# EAGLE schematic board_Nutzen (EAGLE 8.7.0)

## Sheet 1 of 7

## Sheet 2 of 7
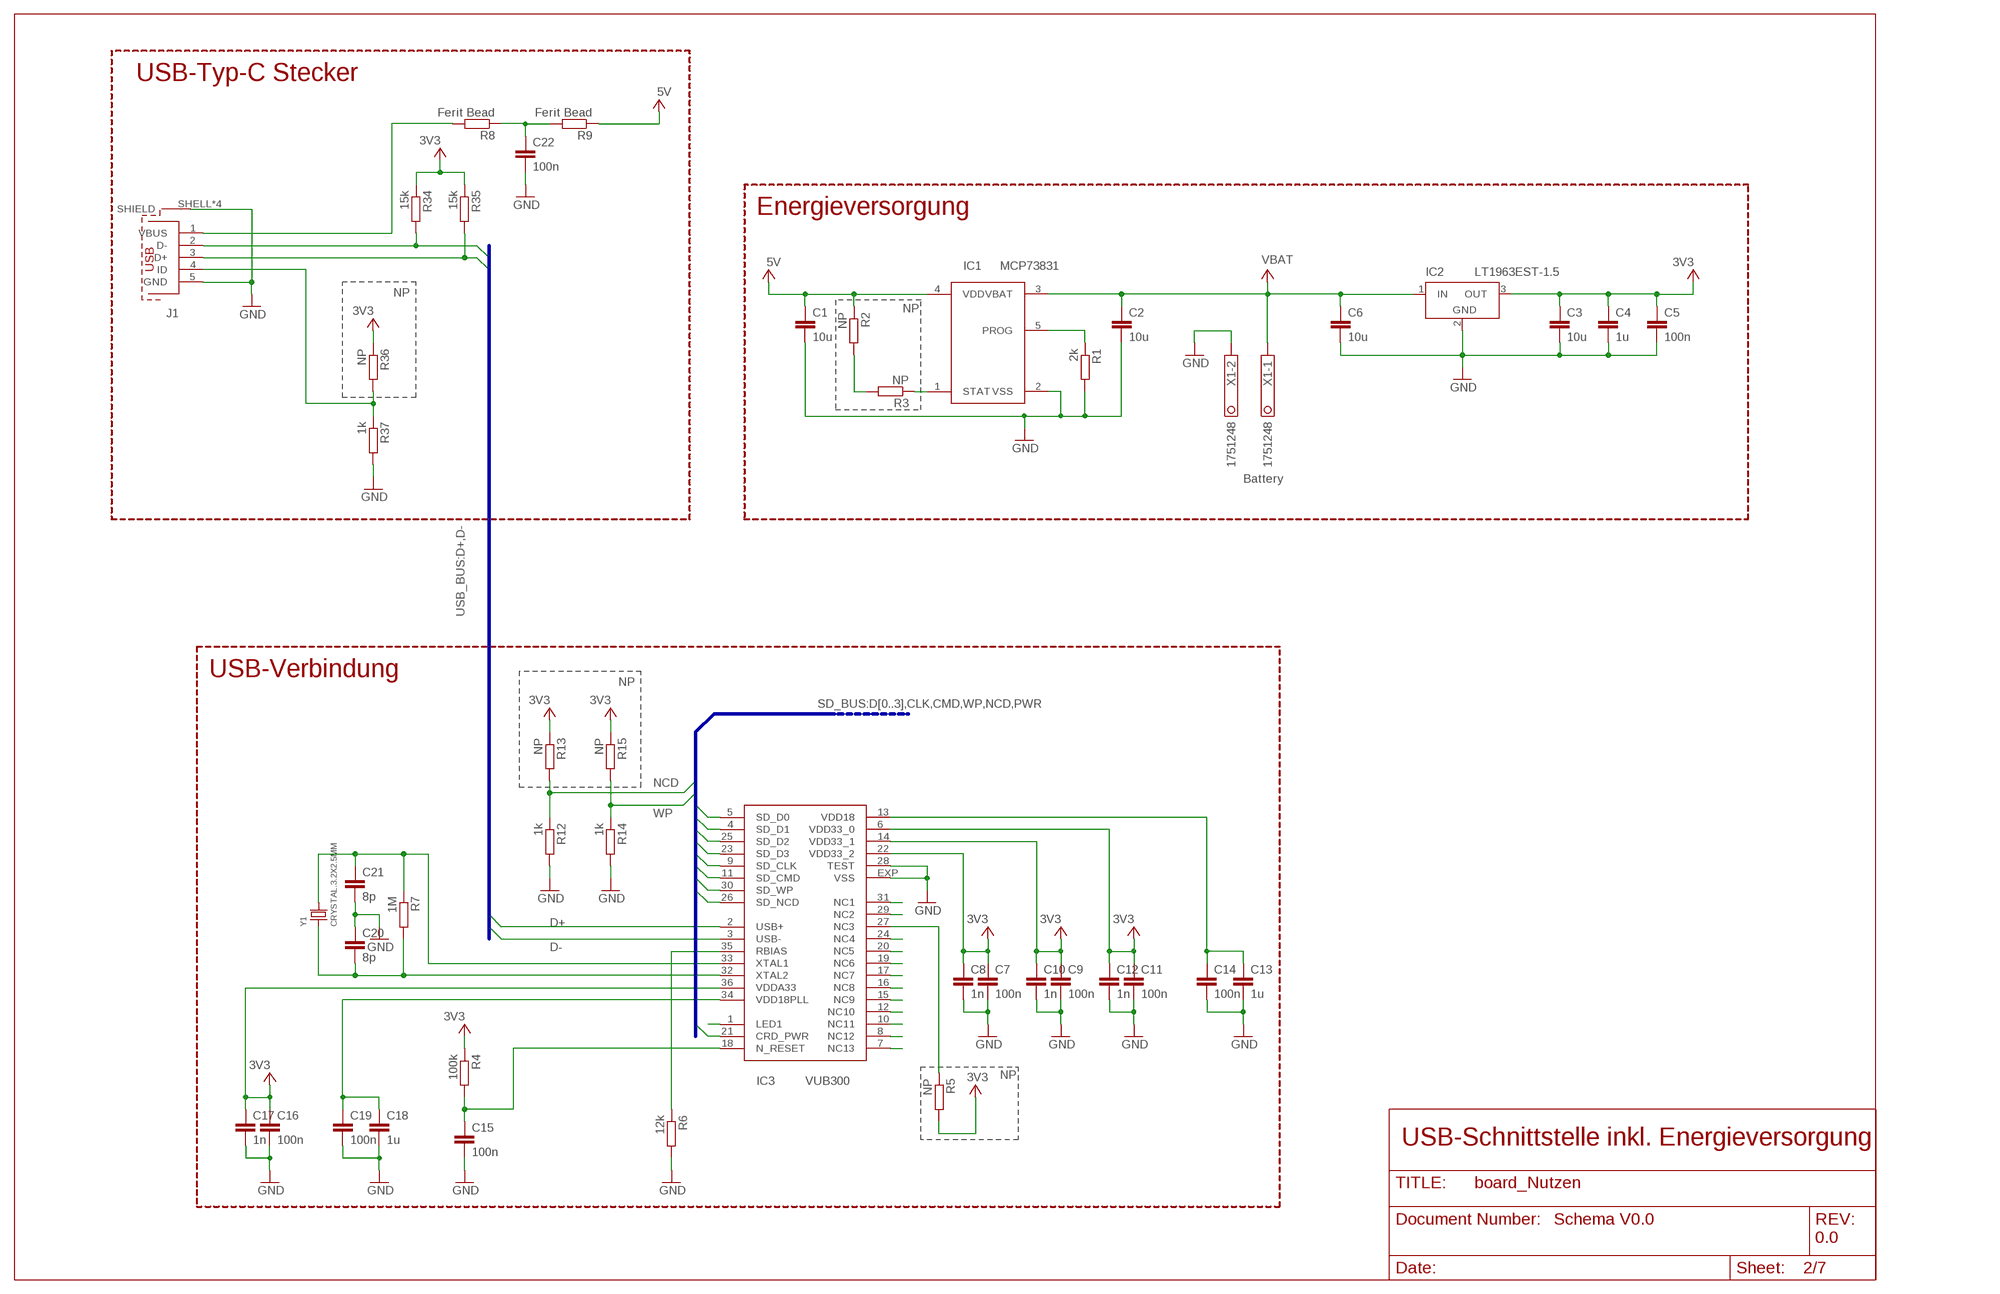
[diagram p0: schematic, sheet 2]

### Parts
C1  10u  C-EUC0805  [C0805]
C2  10u  C-EUC0805  [C0805]
C3  10u  C-EUC0805  [C0805]
C4  1u  C-EUC0603  [C0603]
C5  100n  C-EUC0603  [C0603]
C6  10u  C-EUC0805  [C0805]
C7  100n  C-EUC0402  [C0402]
C8  1n  C-EUC0402  [C0402]
C9  100n  C-EUC0402  [C0402]
C10  1n  C-EUC0402  [C0402]
C11  100n  C-EUC0402  [C0402]
C12  1n  C-EUC0402  [C0402]
C13  1u  C-EUC0402  [C0402]
C14  100n  C-EUC0402  [C0402]
C15  100n  C-EUC0402  [C0402]
C16  100n  C-EUC0402  [C0402]
C17  1n  C-EUC0402  [C0402]
C18  1u  C-EUC0402  [C0402]
C19  100n  C-EUC0402  [C0402]
C20  8p  C-EUC0402  [C0402]
C21  8p  C-EUC0402  [C0402]
C22  100n  C-EUC0603  [C0603]
IC1  MCP73831  [SOT23-5]
IC2  LT1963EST-1.5  [SOT223]
IC3  VUB300  [QFN36-6X6]
J1  629105136821  [629105136821]
R1  2k  R-EU_R0603  [R0603]
R2  NP  R-EU_R0603  [R0603]
R3  NP  R-EU_R0603  [R0603]
R4  100k  R-EU_R0402  [R0402]
R5  NP  R-EU_R0402  [R0402]
R6  12k  R-EU_R0402  [R0402]
R7  1M  R-EU_R0402  [R0402]
R8  Ferit Bead  R-EU_R0603  [R0603]
R9  Ferit Bead  R-EU_R0603  [R0603]
R12  1k  R-EU_R0603  [R0603]
R13  NP  R-EU_R0603  [R0603]
R14  1k  R-EU_R0603  [R0603]
R15  NP  R-EU_R0603  [R0603]
R34  15k  R-EU_R0402  [R0402]
R35  15k  R-EU_R0402  [R0402]
R36  NP  R-EU_R0603  [R0603]
R37  1k  R-EU_R0603  [R0603]
X1  1751248  [1751248]
Y1  CRYSTAL.3.2X2.5MM  [3.2X2.5MM]

### Nets
+3V3: C3.1 C4.1 C5.1 C7.1 C8.1 C9.1 C10.1 C11.1 C12.1 C16.1 C17.1 IC2.3(OUT) IC3.6(VDD33_0) IC3.14(VDD33_1) IC3.22(VDD33_2) IC3.36(VDDA33) R4.1 R5.2 R13.1 R15.1 R34.1 R35.1 R36.1 ; supply symbol labelled 3V3 ; also sheet 3,4,5,6,7
+5V: C1.1 IC1.4(VDD) R2.1 R9.1 ; supply symbol labelled 5V ; also sheet 5
CLK: IC3.9(SD_CLK) ; also sheet 3,5,6
CMD: IC3.11(SD_CMD) ; also sheet 3,5,6
D0: IC3.5(SD_D0) ; also sheet 3,5,6
D1: IC3.4(SD_D1) ; also sheet 3,5,6
D2: IC3.25(SD_D2) ; also sheet 3,5,6
D3: IC3.23(SD_D3) ; also sheet 3,5,6
D+: IC3.2(USB+) J1.3(D+) R35.2 ; also sheet 5
D-: IC3.3(USB-) J1.2(D-) R34.2 ; also sheet 5
GND: C1.2 C2.2 C3.2 C4.2 C5.2 C6.2 C7.2 C8.2 C9.2 C10.2 C11.2 C12.2 C13.2 C14.2 C15.2 C16.2 C17.2 C18.2 C19.2 C20.1 C21.2 C22.2 IC1.2(VSS) IC2.2(GND) IC3.28(TEST) IC3.EXP(VSS) J1.5(GND) J1.SHELL1(SHIELD) J1.SHELL2(SHIELD) J1.SHELL3(SHIELD) J1.SHELL(SHIELD) R1.2 R6.2 R12.2 R14.2 R37.2 X1.2 ; also sheet 3,4,5,6,7
N$1: IC1.5(PROG) R1.1
N$2: R2.2 R3.2
N$3: IC1.1(STAT) R3.1
N$4: IC3.1(LED1)
N$5: J1.4(ID) R36.2 R37.1
N$19: IC3.8(NC12)
N$20: IC3.7(NC13)
N$21: IC3.10(NC11)
N$22: IC3.12(NC10)
N$23: IC3.24(NC4)
N$24: IC3.15(NC9)
N$25: IC3.16(NC8)
N$26: IC3.17(NC7)
N$27: C15.1 IC3.18(N_RESET) R4.2
N$28: IC3.27(NC3) R5.1
N$29: IC3.19(NC6)
N$30: IC3.20(NC5)
N$31: IC3.35(RBIAS) R6.1
N$32: IC3.29(NC2)
N$33: IC3.31(NC1)
N$34: J1.1(VBUS) R8.2
N$35: C20.2 IC3.32(XTAL2) R7.2 Y1.1
N$36: C21.1 IC3.33(XTAL1) R7.1 Y1.3
N$37: C22.1 R8.1 R9.2
NCD: IC3.26(SD_NCD) R12.1 R13.2 ; also sheet 5
PWR: IC3.21(CRD_PWR) ; also sheet 3,5,6
V+: C2.1 C6.1 IC1.3(VBAT) IC2.1(IN) X1.1 ; supply symbol labelled VBAT ; also sheet 4,5,7
VDD18: C13.1 C14.1 IC3.13(VDD18) ; also sheet 5
VDD18PLL: C18.1 C19.1 IC3.34(VDD18PLL) ; also sheet 5
WP: IC3.30(SD_WP) R14.1 R15.2 ; also sheet 5

### Buses
SD_BUS:D[0..3],CLK,CMD,WP,NCD,PWR
USB_BUS:D+,D-

### Notes on the sheet
- USB-Typ-C Stecker
- Energieversorgung
- NP
- NP
- Battery
- USB-Verbindung | NP
- NP
- USB-Schnittstelle inkl. Energieversorgung
- Schema V0.0
- 0.0

## Sheet 3 of 7
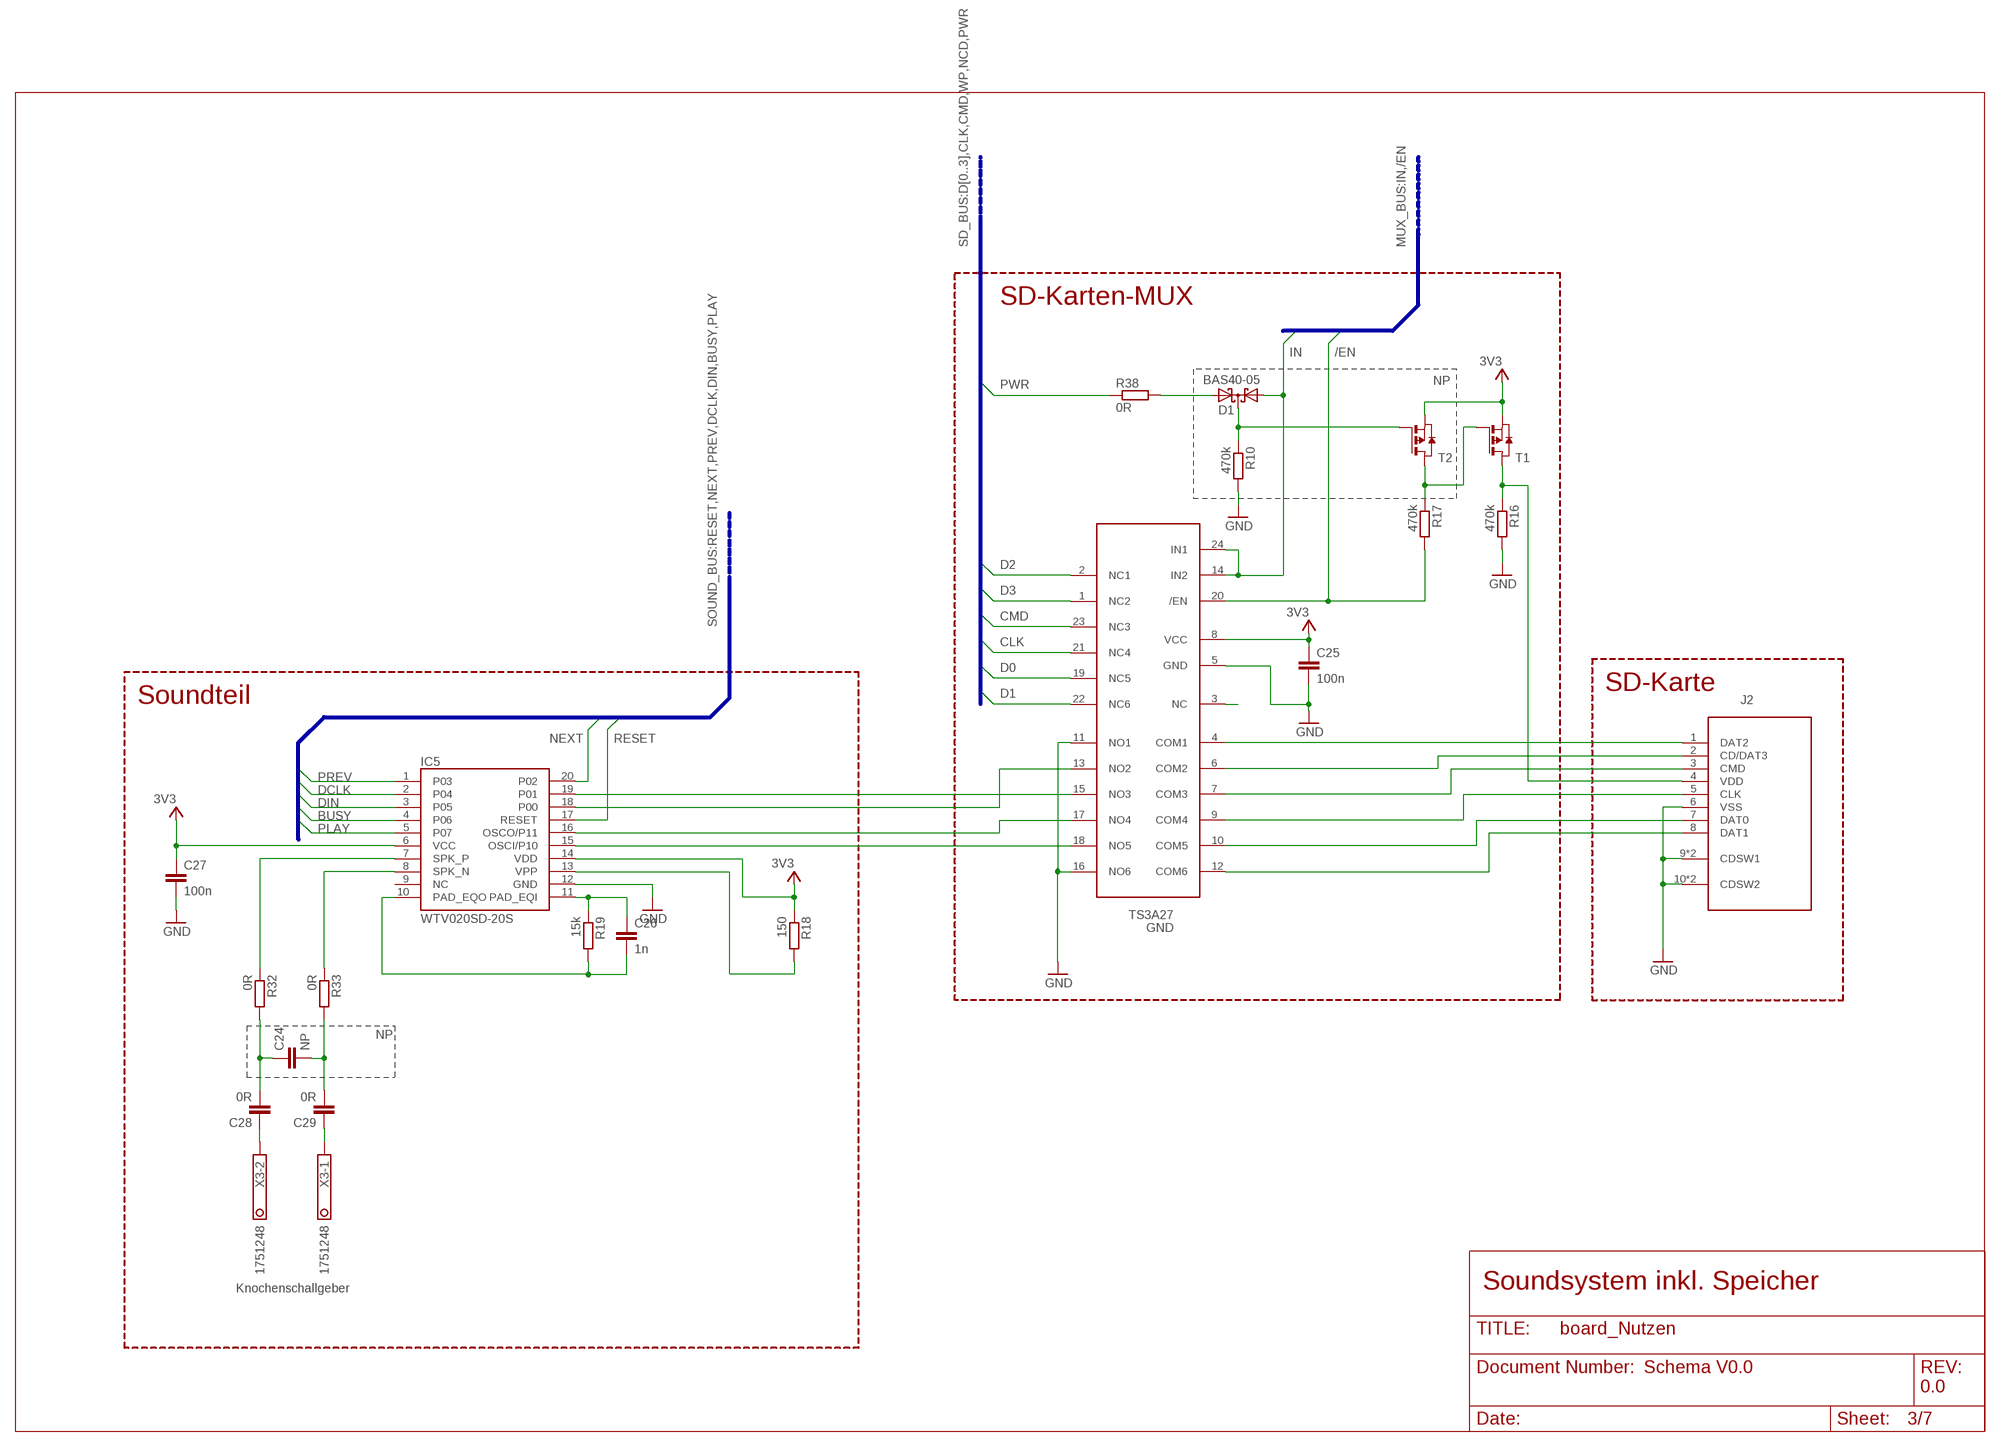
[diagram p1: schematic, sheet 3]

### Parts
C24  NP  C-EUC0603  [C0603]
C25  100n  C-EUC0603  [C0603]
C26  1n  C-EUC0603  [C0603]
C27  100n  C-EUC0603  [C0603]
C28  0R  C-EUC0603  [C0603]
C29  0R  C-EUC0603  [C0603]
D1  BAS40-05  [SOT23]
GND  TS3A27  [TSSOP24]
IC5  WTV020SD-20S  WTV020SD  [SSOP_20]
J2  693071010811  [693071010811]
R10  470k  R-EU_R0603  [R0603]
R16  470k  R-EU_R0603  [R0603]
R17  470k  R-EU_R0603  [R0603]
R18  150  R-EU_R0603  [R0603]
R19  15k  R-EU_R0603  [R0603]
R32  0R  R-EU_R0603  [R0603]
R33  0R  R-EU_R0603  [R0603]
R38  0R  R-EU_MELF0102W  [MINI_MELF-0102W]
T1  PMOSSOT23  [SOT-23]
T2  PMOSSOT23  [SOT-23]
X3  1751248  [1751248]

### Nets
+3V3: C25.1 C27.1 GND.8(VCC) IC5.6(VCC) IC5.14(VDD) R18.1 T1.2(S) T2.2(S) ; supply symbol labelled 3V3 ; also sheet 2,4,5,6,7
/EN: GND.20(/EN) R17.2 ; also sheet 4,6,7
BUSY: IC5.4(P06) ; also sheet 4,6,7
CLK: GND.21(NC4) ; also sheet 2,5,6
CMD: GND.23(NC3) ; also sheet 2,5,6
D0: GND.19(NC5) ; also sheet 2,5,6
D1: GND.22(NC6) ; also sheet 2,5,6
D2: GND.2(NC1) ; also sheet 2,5,6
D3: GND.1(NC2) ; also sheet 2,5,6
DCLK: IC5.2(P04) ; also sheet 4,6,7
DIN: IC5.3(P05) ; also sheet 4,6,7
GND: C25.2 C27.2 GND.5(GND) GND.11(NO1) GND.16(NO6) IC5.12(GND) J2.6(VSS) J2.9(CDSW1) J2.9-1(CDSW1) J2.10(CDSW2) J2.10-1(CDSW2) R10.2 R16.2 ; also sheet 2,4,5,6,7
IN: D1.1(A1) GND.14(IN2) GND.24(IN1) ; also sheet 4,6,7
N$8: D1.2(A2) R38.2
N$9: GND.15(NO3) IC5.19(P01)
N$38: GND.9(COM4) J2.5(CLK)
N$39: IC5.13(VPP) R18.2
N$40: C26.1 IC5.11(PAD_EQI) R19.1
N$41: GND.17(NO4) IC5.16(OSCO/P11)
N$42: GND.18(NO5) IC5.15(OSCI/P10)
N$43: GND.4(COM1) J2.1(DAT2)
N$44: GND.12(COM6) J2.8(DAT1)
N$45: GND.6(COM2) J2.2(CD/DAT3)
N$46: R17.1 T1.3(G) T2.1(D)
N$47: GND.3(NC)
N$49: D1.3(C) R10.1 T2.3(G)
N$56: C28.1 X3.2
N$57: C29.1 X3.1
N$58: C24.2 C29.2 R33.2
N$59: C24.1 C28.2 R32.2
NCD1: J2.4(VDD) R16.1 T1.1(D)
NEXT: IC5.20(P02) ; also sheet 4,6,7
PLAY: IC5.5(P07) ; also sheet 4,6,7
PREV: IC5.1(P03) ; also sheet 4,6,7
PWM: C26.2 IC5.10(PAD_EQO) R19.2
PWR: R38.1 ; also sheet 2,5,6
RESET: IC5.17(RESET) ; also sheet 4,6,7
SDCS: GND.13(NO2) IC5.18(P00)
SDDI: GND.7(COM3) J2.3(CMD)
SDDO: GND.10(COM5) J2.7(DAT0)
SPK+: IC5.7(SPK_P) R32.1
SPK-: IC5.8(SPK_N) R33.1
Unconnected: IC5.9(NC)

### Buses
SD_BUS:D[0..3],CLK,CMD,WP,NCD,PWR
MUX_BUS:IN,/EN
SOUND_BUS:RESET,NEXT,PREV,DCLK,DIN,BUSY,PLAY

### Notes on the sheet
- SD-Karten-MUX
- NP
- SD-Karte
- Soundteil
- NP
- Knochenschallgeber
- Soundsystem inkl. Speicher
- Schema V0.0
- 0.0

## Sheet 4 of 7
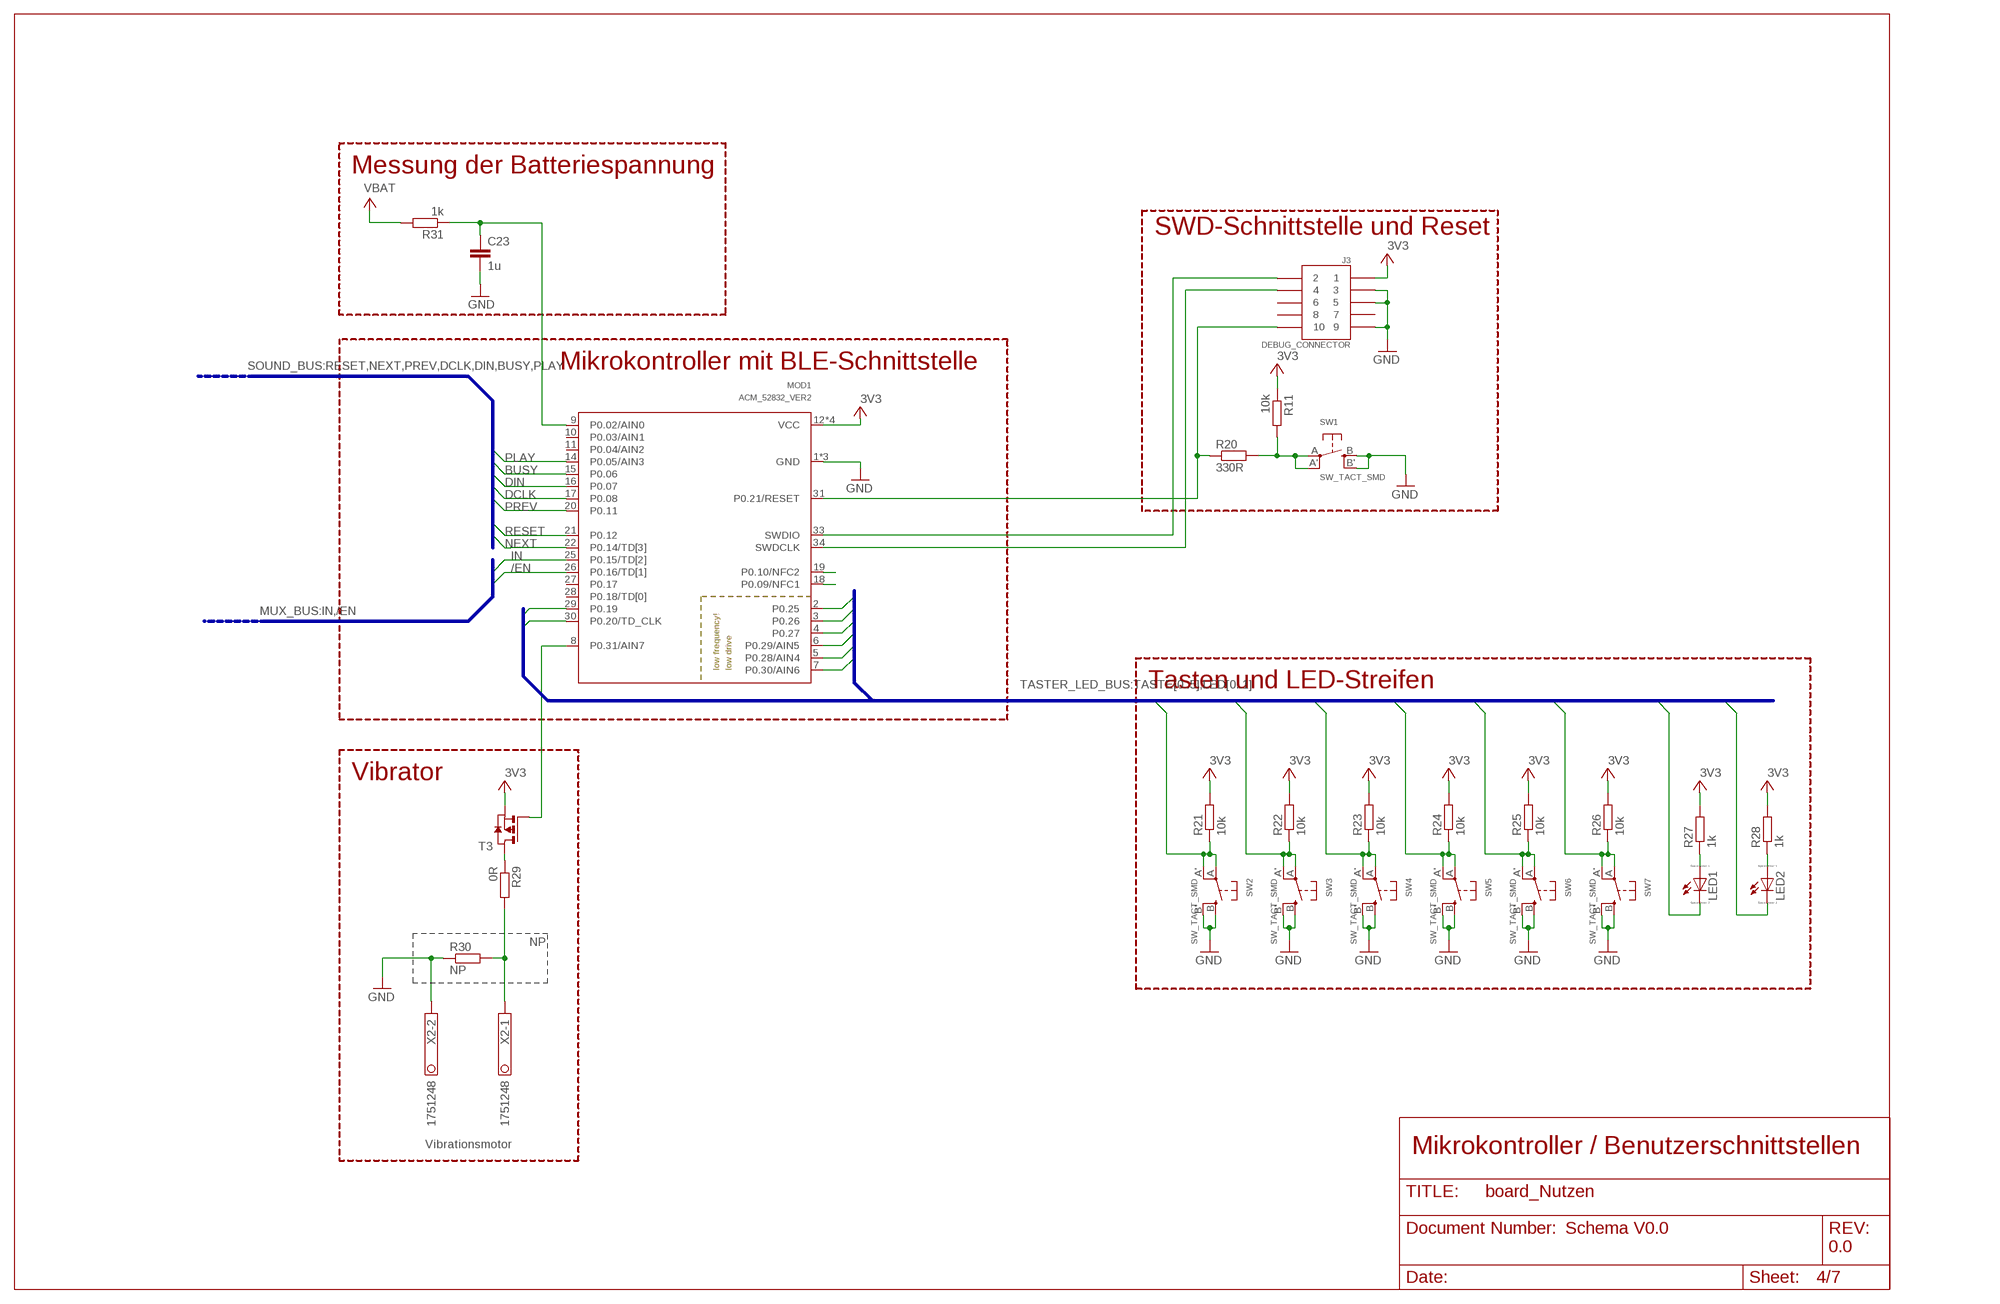
[diagram p2: schematic, sheet 4]

### Parts
C23  1u  C-EUC0603  [C0603]
J3  DEBUG_CONNECTOR  [HDRV127P5X2-10_N]
LED1  LED_E  [LED_1206]
LED2  LED_E  [LED_1206]
MOD1  ACM_52832_VER2  [ACONNO_ACM_52832]
R11  10k  R-EU_R0603  [R0603]
R20  330R  R-EU_R0603  [R0603]
R21  10k  R-EU_R0603  [R0603]
R22  10k  R-EU_R0603  [R0603]
R23  10k  R-EU_R0603  [R0603]
R24  10k  R-EU_R0603  [R0603]
R25  10k  R-EU_R0603  [R0603]
R26  10k  R-EU_R0603  [R0603]
R27  1k  R-EU_R0603  [R0603]
R28  1k  R-EU_R0603  [R0603]
R29  0R  R-EU_R0603  [R0603]
R30  NP  R-EU_R0603  [R0603]
R31  1k  R-EU_R0603  [R0603]
SW1  SW_TACT_SMD  [EVQ-Q2]
SW2  SW_TACT_SMD  [EVQ-Q2]
SW3  SW_TACT_SMD  [EVQ-Q2]
SW4  SW_TACT_SMD  [EVQ-Q2]
SW5  SW_TACT_SMD  [EVQ-Q2]
SW6  SW_TACT_SMD  [EVQ-Q2]
SW7  SW_TACT_SMD  [EVQ-Q2]
T3  PMOSSOT23  [SOT-23]
X2  1751248  [1751248]

### Nets
+3V3: J3.1 MOD1.12(VCC) MOD1.23(VCC) MOD1.24(VCC) MOD1.32(VCC) R11.1 R21.2 R22.2 R23.2 R24.2 R25.2 R26.2 R27.2 R28.2 T3.2(S) ; supply symbol labelled 3V3 ; also sheet 2,3,5,6,7
/EN: MOD1.26(P0.16/TD[1]) ; also sheet 3,6,7
BUSY: MOD1.15(P0.06) ; also sheet 3,6,7
DCLK: MOD1.17(P0.08) ; also sheet 3,6,7
DIN: MOD1.16(P0.07) ; also sheet 3,6,7
GND: C23.2 J3.3 J3.5 J3.9 MOD1.1(GND) MOD1.13(GND) MOD1.35(GND) R30.1 SW1.B'(S1) SW1.B(S) SW2.B'(S1) SW2.B(S) SW3.B'(S1) SW3.B(S) SW4.B'(S1) SW4.B(S) SW5.B'(S1) SW5.B(S) SW6.B'(S1) SW6.B(S) SW7.B'(S1) SW7.B(S) X2.2 ; also sheet 2,3,5,6,7
IN: MOD1.25(P0.15/TD[2]) ; also sheet 3,6,7
LED0: LED1.C MOD1.29(P0.19) ; also sheet 7
LED1: LED2.C MOD1.30(P0.20/TD_CLK) ; also sheet 7
N$6: MOD1.19(P0.10/NFC2)
N$7: MOD1.18(P0.09/NFC1)
N$48: R11.2 R20.2 SW1.A'(P1) SW1.A(P)
N$50: J3.4 MOD1.34(SWDCLK)
N$52: J3.10 MOD1.31(P0.21/RESET) R20.1
N$53: J3.2 MOD1.33(SWDIO)
N$54: LED1.A R27.1
N$55: C23.1 MOD1.9(P0.02/AIN0) R31.1
N$61: LED2.A R28.1
N$63: R29.2 R30.2 X2.1
N$64: MOD1.8(P0.31/AIN7) T3.3(G)
N$65: R29.1 T3.1(D)
NEXT: MOD1.22(P0.14/TD[3]) ; also sheet 3,6,7
PLAY: MOD1.14(P0.05/AIN3) ; also sheet 3,6,7
PREV: MOD1.20(P0.11) ; also sheet 3,6,7
RESET: MOD1.21(P0.12) ; also sheet 3,6,7
TASTE0: MOD1.7(P0.30/AIN6) R21.1 SW2.A'(P1) SW2.A(P) ; also sheet 7
TASTE1: MOD1.5(P0.28/AIN4) R22.1 SW3.A'(P1) SW3.A(P) ; also sheet 7
TASTE2: MOD1.6(P0.29/AIN5) R23.1 SW4.A'(P1) SW4.A(P) ; also sheet 7
TASTE3: MOD1.4(P0.27) R24.1 SW5.A'(P1) SW5.A(P) ; also sheet 7
TASTE4: MOD1.3(P0.26) R25.1 SW6.A'(P1) SW6.A(P) ; also sheet 7
TASTE5: MOD1.2(P0.25) R26.1 SW7.A'(P1) SW7.A(P) ; also sheet 7
V+: R31.2 ; supply symbol labelled VBAT ; also sheet 2,5,7
Unconnected: J3.6 J3.7 J3.8 MOD1.10(P0.03/AIN1) MOD1.11(P0.04/AIN2) MOD1.27(P0.17) MOD1.28(P0.18/TD[0])

### Buses
SOUND_BUS:RESET,NEXT,PREV,DCLK,DIN,BUSY,PLAY
MUX_BUS:IN,/EN
TASTER_LED_BUS:TASTE[0..5],LED[0..1]

### Notes on the sheet
- Messung der Batteriespannung
- SWD-Schnittstelle und Reset
- Mikrokontroller mit BLE-Schnittstelle
- Tasten und LED-Streifen
- Vibrator
- NP
- Vibrationsmotor
- Mikrokontroller / Benutzerschnittstellen
- Schema V0.0
- 0.0

## Sheet 5 of 7
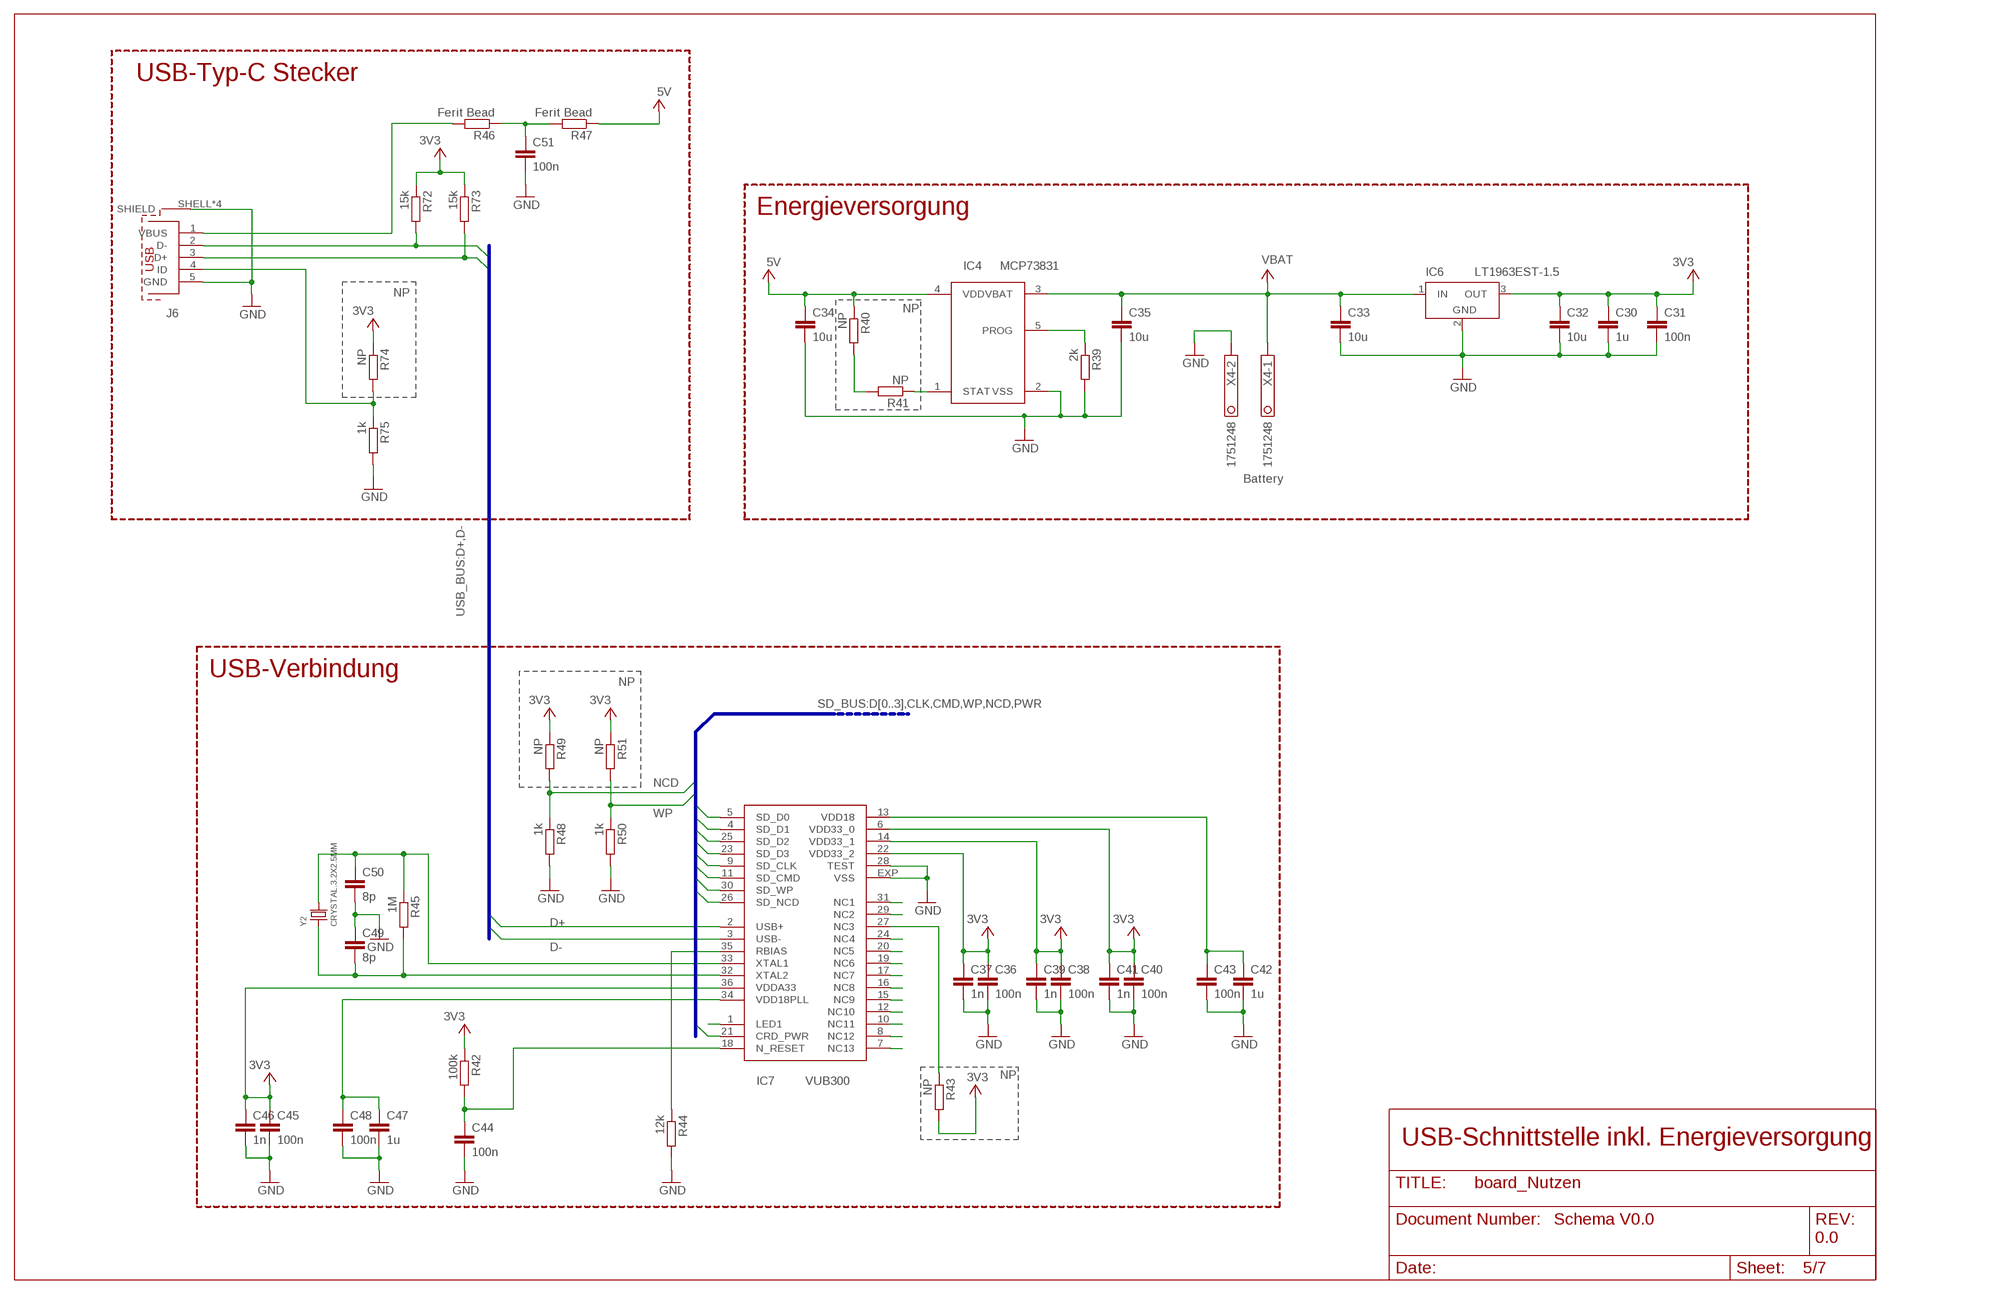
[diagram p3: schematic, sheet 5]

### Parts
C30  1u  C-EUC0603  [C0603]
C31  100n  C-EUC0603  [C0603]
C32  10u  C-EUC0805  [C0805]
C33  10u  C-EUC0805  [C0805]
C34  10u  C-EUC0805  [C0805]
C35  10u  C-EUC0805  [C0805]
C36  100n  C-EUC0402  [C0402]
C37  1n  C-EUC0402  [C0402]
C38  100n  C-EUC0402  [C0402]
C39  1n  C-EUC0402  [C0402]
C40  100n  C-EUC0402  [C0402]
C41  1n  C-EUC0402  [C0402]
C42  1u  C-EUC0402  [C0402]
C43  100n  C-EUC0402  [C0402]
C44  100n  C-EUC0402  [C0402]
C45  100n  C-EUC0402  [C0402]
C46  1n  C-EUC0402  [C0402]
C47  1u  C-EUC0402  [C0402]
C48  100n  C-EUC0402  [C0402]
C49  8p  C-EUC0402  [C0402]
C50  8p  C-EUC0402  [C0402]
C51  100n  C-EUC0603  [C0603]
IC4  MCP73831  [SOT23-5]
IC6  LT1963EST-1.5  [SOT223]
IC7  VUB300  [QFN36-6X6]
J6  629105136821  [629105136821]
R39  2k  R-EU_R0603  [R0603]
R40  NP  R-EU_R0603  [R0603]
R41  NP  R-EU_R0603  [R0603]
R42  100k  R-EU_R0402  [R0402]
R43  NP  R-EU_R0402  [R0402]
R44  12k  R-EU_R0402  [R0402]
R45  1M  R-EU_R0402  [R0402]
R46  Ferit Bead  R-EU_R0603  [R0603]
R47  Ferit Bead  R-EU_R0603  [R0603]
R48  1k  R-EU_R0603  [R0603]
R49  NP  R-EU_R0603  [R0603]
R50  1k  R-EU_R0603  [R0603]
R51  NP  R-EU_R0603  [R0603]
R72  15k  R-EU_R0402  [R0402]
R73  15k  R-EU_R0402  [R0402]
R74  NP  R-EU_R0603  [R0603]
R75  1k  R-EU_R0603  [R0603]
X4  1751248  [1751248]
Y2  CRYSTAL.3.2X2.5MM  [3.2X2.5MM]

### Nets
+3V3: C30.1 C31.1 C32.1 C36.1 C37.1 C38.1 C39.1 C40.1 C41.1 C45.1 C46.1 IC6.3(OUT) IC7.6(VDD33_0) IC7.14(VDD33_1) IC7.22(VDD33_2) IC7.36(VDDA33) R42.1 R43.2 R49.1 R51.1 R72.1 R73.1 R74.1 ; supply symbol labelled 3V3 ; also sheet 2,3,4,6,7
+5V: C34.1 IC4.4(VDD) R40.1 R47.1 ; supply symbol labelled 5V ; also sheet 2
CLK: IC7.9(SD_CLK) ; also sheet 2,3,6
CMD: IC7.11(SD_CMD) ; also sheet 2,3,6
D0: IC7.5(SD_D0) ; also sheet 2,3,6
D1: IC7.4(SD_D1) ; also sheet 2,3,6
D2: IC7.25(SD_D2) ; also sheet 2,3,6
D3: IC7.23(SD_D3) ; also sheet 2,3,6
D+: IC7.2(USB+) J6.3(D+) R73.2 ; also sheet 2
D-: IC7.3(USB-) J6.2(D-) R72.2 ; also sheet 2
GND: C30.2 C31.2 C32.2 C33.2 C34.2 C35.2 C36.2 C37.2 C38.2 C39.2 C40.2 C41.2 C42.2 C43.2 C44.2 C45.2 C46.2 C47.2 C48.2 C49.1 C50.2 C51.2 IC4.2(VSS) IC6.2(GND) IC7.28(TEST) IC7.EXP(VSS) J6.5(GND) J6.SHELL1(SHIELD) J6.SHELL2(SHIELD) J6.SHELL3(SHIELD) J6.SHELL(SHIELD) R39.2 R44.2 R48.2 R50.2 R75.2 X4.2 ; also sheet 2,3,4,6,7
N$10: IC4.5(PROG) R39.1
N$11: R40.2 R41.2
N$12: IC4.1(STAT) R41.1
N$13: IC7.1(LED1)
N$14: IC7.8(NC12)
N$15: IC7.7(NC13)
N$16: IC7.10(NC11)
N$17: IC7.12(NC10)
N$18: IC7.15(NC9)
N$60: IC7.16(NC8)
N$62: IC7.17(NC7)
N$66: C44.1 IC7.18(N_RESET) R42.2
N$67: IC7.19(NC6)
N$68: IC7.20(NC5)
N$69: IC7.24(NC4)
N$70: IC7.27(NC3) R43.1
N$71: IC7.29(NC2)
N$72: IC7.31(NC1)
N$73: IC7.35(RBIAS) R44.1
N$74: C49.2 IC7.32(XTAL2) R45.2 Y2.1
N$75: C50.1 IC7.33(XTAL1) R45.1 Y2.3
N$76: J6.1(VBUS) R46.2
N$77: C51.1 R46.1 R47.2
N$78: J6.4(ID) R74.2 R75.1
NCD: IC7.26(SD_NCD) R48.1 R49.2 ; also sheet 2
PWR: IC7.21(CRD_PWR) ; also sheet 2,3,6
V+: C33.1 C35.1 IC4.3(VBAT) IC6.1(IN) X4.1 ; supply symbol labelled VBAT ; also sheet 2,4,7
VDD18: C42.1 C43.1 IC7.13(VDD18) ; also sheet 2
VDD18PLL: C47.1 C48.1 IC7.34(VDD18PLL) ; also sheet 2
WP: IC7.30(SD_WP) R50.1 R51.2 ; also sheet 2

### Buses
SD_BUS:D[0..3],CLK,CMD,WP,NCD,PWR
USB_BUS:D+,D-

### Notes on the sheet
- USB-Typ-C Stecker
- Energieversorgung
- NP
- NP
- Battery
- USB-Verbindung | NP
- NP
- USB-Schnittstelle inkl. Energieversorgung
- Schema V0.0
- 0.0

## Sheet 6 of 7
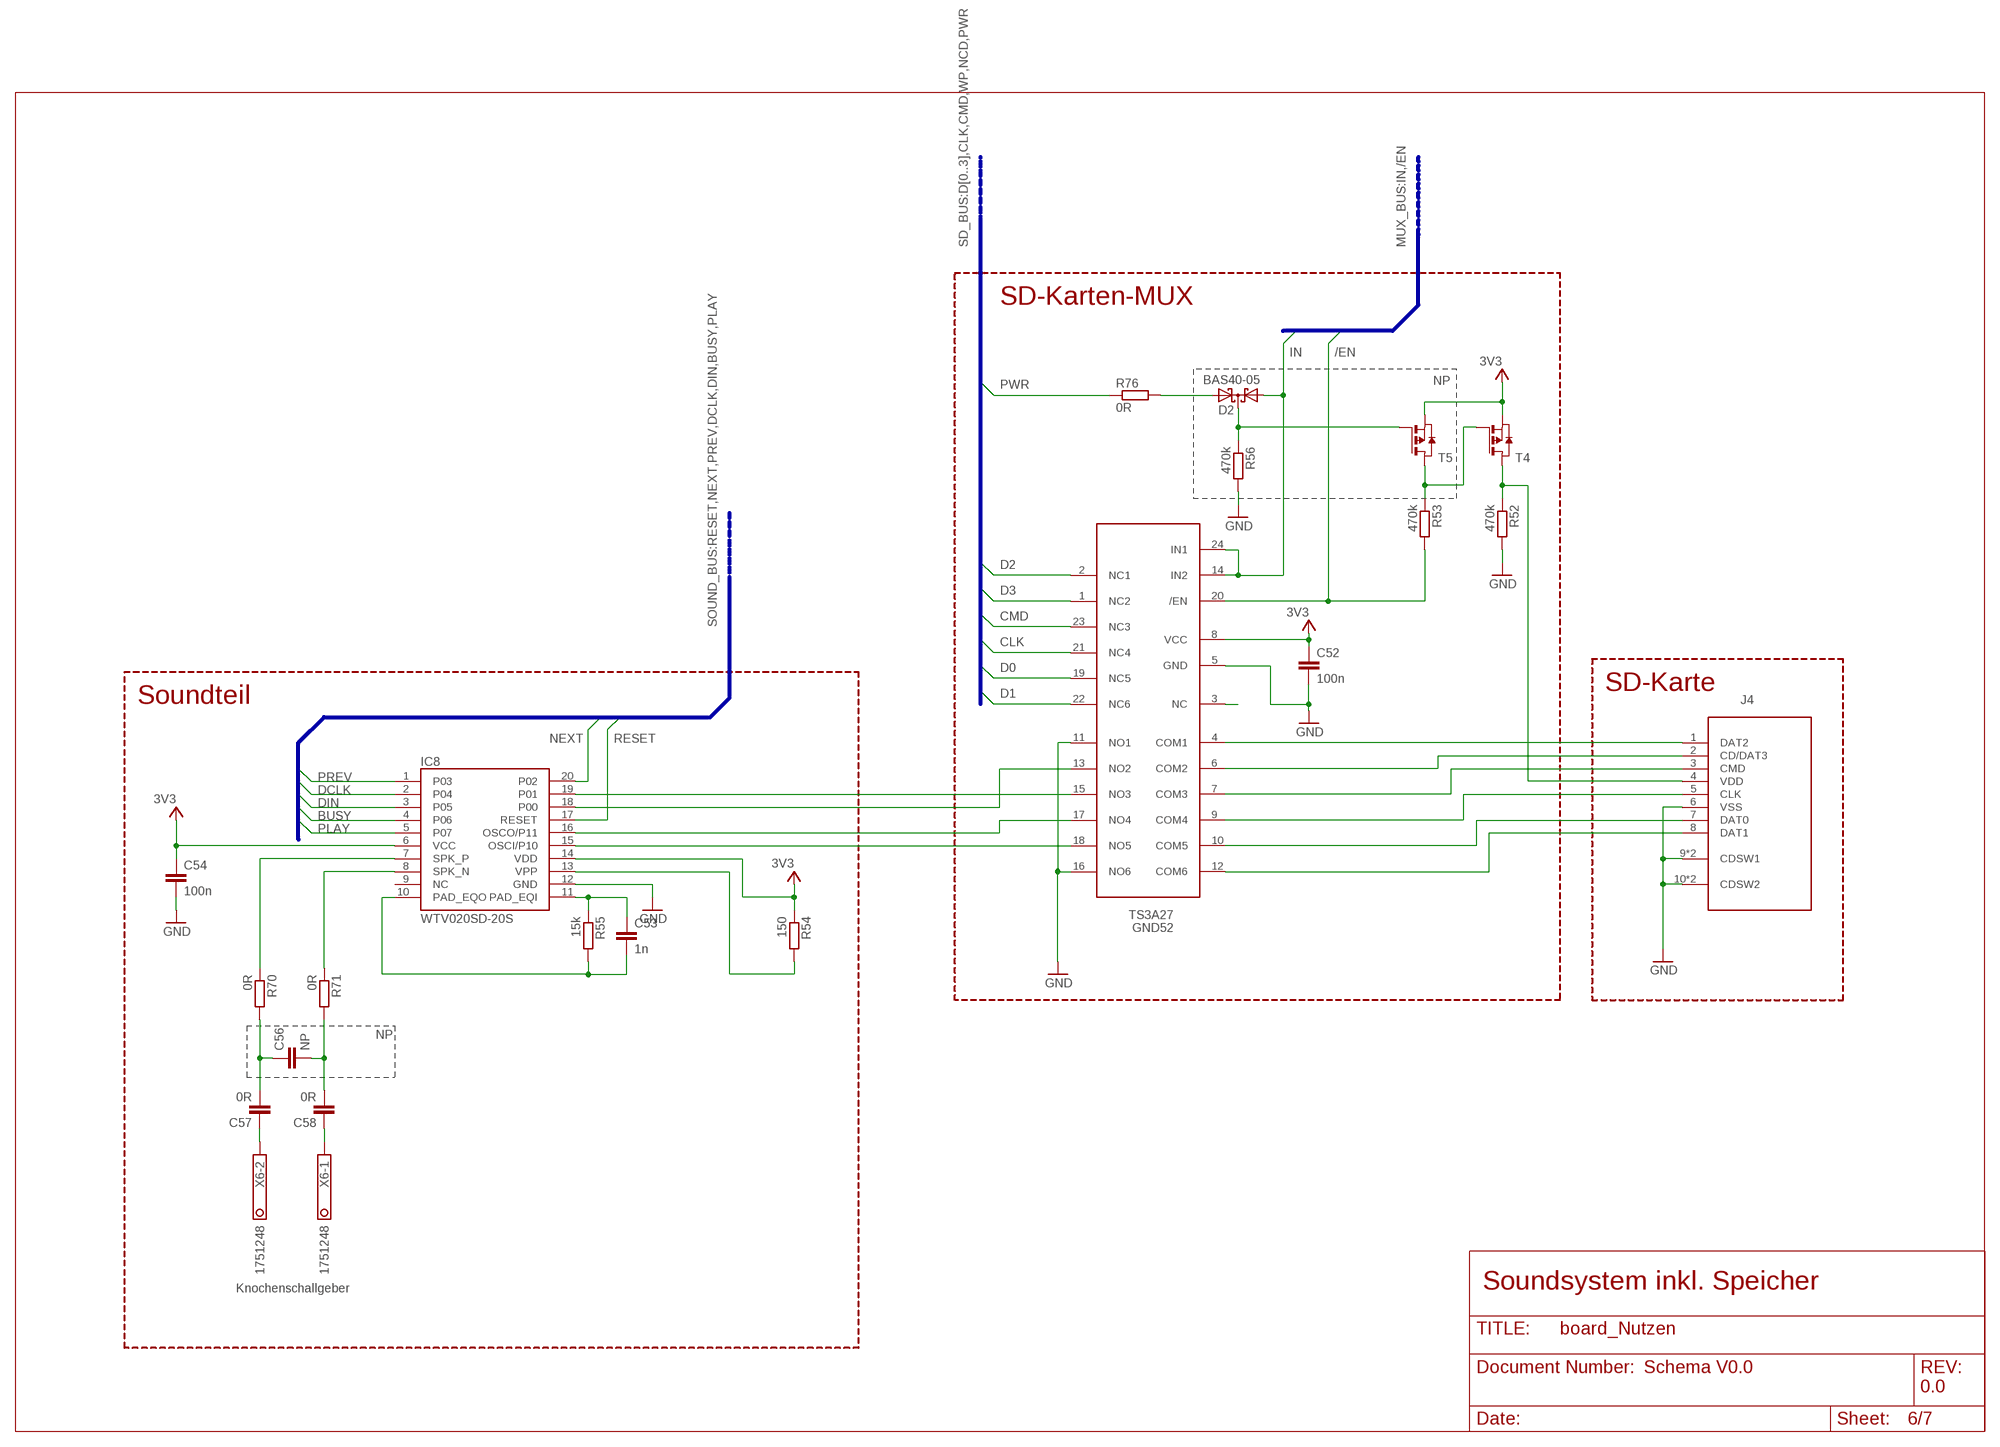
[diagram p4: schematic, sheet 6]

### Parts
C52  100n  C-EUC0603  [C0603]
C53  1n  C-EUC0603  [C0603]
C54  100n  C-EUC0603  [C0603]
C56  NP  C-EUC0603  [C0603]
C57  0R  C-EUC0603  [C0603]
C58  0R  C-EUC0603  [C0603]
D2  BAS40-05  [SOT23]
GND52  TS3A27  [TSSOP24]
IC8  WTV020SD-20S  WTV020SD  [SSOP_20]
J4  693071010811  [693071010811]
R52  470k  R-EU_R0603  [R0603]
R53  470k  R-EU_R0603  [R0603]
R54  150  R-EU_R0603  [R0603]
R55  15k  R-EU_R0603  [R0603]
R56  470k  R-EU_R0603  [R0603]
R70  0R  R-EU_R0603  [R0603]
R71  0R  R-EU_R0603  [R0603]
R76  0R  R-EU_MELF0102W  [MINI_MELF-0102W]
T4  PMOSSOT23  [SOT-23]
T5  PMOSSOT23  [SOT-23]
X6  1751248  [1751248]

### Nets
+3V3: C52.1 C54.1 GND52.8(VCC) IC8.6(VCC) IC8.14(VDD) R54.1 T4.2(S) T5.2(S) ; supply symbol labelled 3V3 ; also sheet 2,3,4,5,7
/EN: GND52.20(/EN) R53.2 ; also sheet 3,4,7
BUSY: IC8.4(P06) ; also sheet 3,4,7
CLK: GND52.21(NC4) ; also sheet 2,3,5
CMD: GND52.23(NC3) ; also sheet 2,3,5
D0: GND52.19(NC5) ; also sheet 2,3,5
D1: GND52.22(NC6) ; also sheet 2,3,5
D2: GND52.2(NC1) ; also sheet 2,3,5
D3: GND52.1(NC2) ; also sheet 2,3,5
DCLK: IC8.2(P04) ; also sheet 3,4,7
DIN: IC8.3(P05) ; also sheet 3,4,7
GND: C52.2 C54.2 GND52.5(GND) GND52.11(NO1) GND52.16(NO6) IC8.12(GND) J4.6(VSS) J4.9(CDSW1) J4.9-1(CDSW1) J4.10(CDSW2) J4.10-1(CDSW2) R52.2 R56.2 ; also sheet 2,3,4,5,7
IN: D2.1(A1) GND52.14(IN2) GND52.24(IN1) ; also sheet 3,4,7
N$79: GND52.9(COM4) J4.5(CLK)
N$80: IC8.13(VPP) R54.2
N$81: C53.1 IC8.11(PAD_EQI) R55.1
N$82: GND52.17(NO4) IC8.16(OSCO/P11)
N$83: GND52.18(NO5) IC8.15(OSCI/P10)
N$84: GND52.6(COM2) J4.2(CD/DAT3)
N$85: GND52.4(COM1) J4.1(DAT2)
N$86: GND52.12(COM6) J4.8(DAT1)
N$87: R53.1 T4.3(G) T5.1(D)
N$88: GND52.3(NC)
N$89: D2.3(C) R56.1 T5.3(G)
N$90: C57.1 X6.2
N$91: C58.1 X6.1
N$92: C56.2 C58.2 R71.2
N$93: C56.1 C57.2 R70.2
N$94: D2.2(A2) R76.2
N$95: GND52.15(NO3) IC8.19(P01)
NCD2: J4.4(VDD) R52.1 T4.1(D)
NEXT: IC8.20(P02) ; also sheet 3,4,7
PLAY: IC8.5(P07) ; also sheet 3,4,7
PREV: IC8.1(P03) ; also sheet 3,4,7
PWM1: C53.2 IC8.10(PAD_EQO) R55.2
PWR: R76.1 ; also sheet 2,3,5
RESET: IC8.17(RESET) ; also sheet 3,4,7
SDCS1: GND52.13(NO2) IC8.18(P00)
SDDI1: GND52.7(COM3) J4.3(CMD)
SDDO1: GND52.10(COM5) J4.7(DAT0)
SPK+1: IC8.7(SPK_P) R70.1
SPK-1: IC8.8(SPK_N) R71.1
Unconnected: IC8.9(NC)

### Buses
SD_BUS:D[0..3],CLK,CMD,WP,NCD,PWR
MUX_BUS:IN,/EN
SOUND_BUS:RESET,NEXT,PREV,DCLK,DIN,BUSY,PLAY

### Notes on the sheet
- SD-Karten-MUX
- NP
- SD-Karte
- Soundteil
- NP
- Knochenschallgeber
- Soundsystem inkl. Speicher
- Schema V0.0
- 0.0

## Sheet 7 of 7
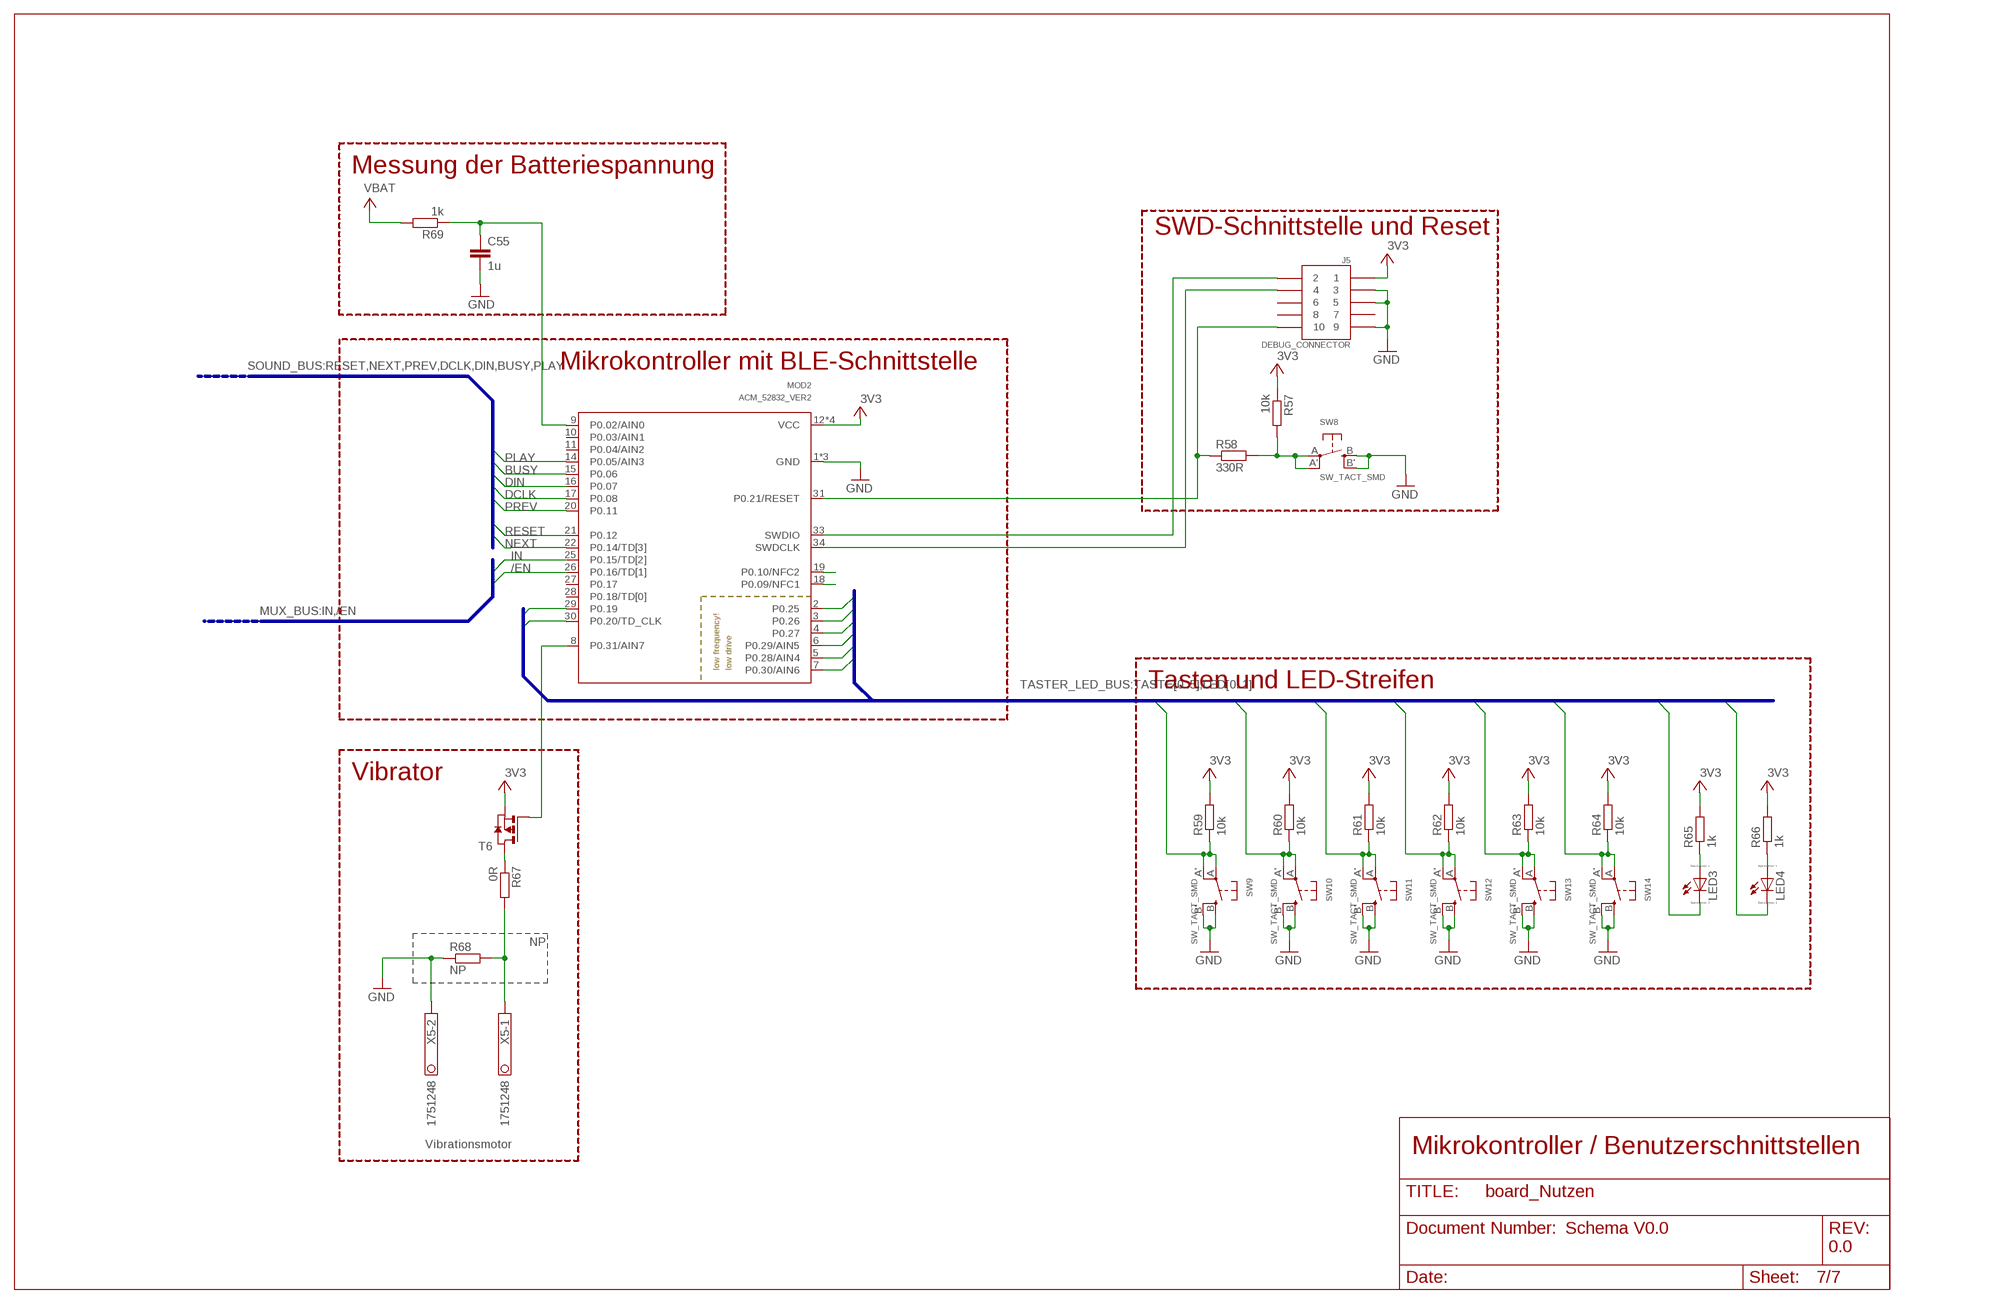
[diagram p5: schematic, sheet 7]

### Parts
C55  1u  C-EUC0603  [C0603]
J5  DEBUG_CONNECTOR  [HDRV127P5X2-10_N]
LED3  LED_E  [LED_1206]
LED4  LED_E  [LED_1206]
MOD2  ACM_52832_VER2  [ACONNO_ACM_52832]
R57  10k  R-EU_R0603  [R0603]
R58  330R  R-EU_R0603  [R0603]
R59  10k  R-EU_R0603  [R0603]
R60  10k  R-EU_R0603  [R0603]
R61  10k  R-EU_R0603  [R0603]
R62  10k  R-EU_R0603  [R0603]
R63  10k  R-EU_R0603  [R0603]
R64  10k  R-EU_R0603  [R0603]
R65  1k  R-EU_R0603  [R0603]
R66  1k  R-EU_R0603  [R0603]
R67  0R  R-EU_R0603  [R0603]
R68  NP  R-EU_R0603  [R0603]
R69  1k  R-EU_R0603  [R0603]
SW8  SW_TACT_SMD  [EVQ-Q2]
SW9  SW_TACT_SMD  [EVQ-Q2]
SW10  SW_TACT_SMD  [EVQ-Q2]
SW11  SW_TACT_SMD  [EVQ-Q2]
SW12  SW_TACT_SMD  [EVQ-Q2]
SW13  SW_TACT_SMD  [EVQ-Q2]
SW14  SW_TACT_SMD  [EVQ-Q2]
T6  PMOSSOT23  [SOT-23]
X5  1751248  [1751248]

### Nets
+3V3: J5.1 MOD2.12(VCC) MOD2.23(VCC) MOD2.24(VCC) MOD2.32(VCC) R57.1 R59.2 R60.2 R61.2 R62.2 R63.2 R64.2 R65.2 R66.2 T6.2(S) ; supply symbol labelled 3V3 ; also sheet 2,3,4,5,6
/EN: MOD2.26(P0.16/TD[1]) ; also sheet 3,4,6
BUSY: MOD2.15(P0.06) ; also sheet 3,4,6
DCLK: MOD2.17(P0.08) ; also sheet 3,4,6
DIN: MOD2.16(P0.07) ; also sheet 3,4,6
GND: C55.2 J5.3 J5.5 J5.9 MOD2.1(GND) MOD2.13(GND) MOD2.35(GND) R68.1 SW8.B'(S1) SW8.B(S) SW9.B'(S1) SW9.B(S) SW10.B'(S1) SW10.B(S) SW11.B'(S1) SW11.B(S) SW12.B'(S1) SW12.B(S) SW13.B'(S1) SW13.B(S) SW14.B'(S1) SW14.B(S) X5.2 ; also sheet 2,3,4,5,6
IN: MOD2.25(P0.15/TD[2]) ; also sheet 3,4,6
LED0: LED3.C MOD2.29(P0.19) ; also sheet 4
LED1: LED4.C MOD2.30(P0.20/TD_CLK) ; also sheet 4
N$96: R57.2 R58.2 SW8.A'(P1) SW8.A(P)
N$97: J5.10 MOD2.31(P0.21/RESET) R58.1
N$98: J5.2 MOD2.33(SWDIO)
N$99: J5.4 MOD2.34(SWDCLK)
N$100: LED3.A R65.1
N$101: LED4.A R66.1
N$102: MOD2.8(P0.31/AIN7) T6.3(G)
N$103: R67.2 R68.2 X5.1
N$104: R67.1 T6.1(D)
N$105: C55.1 MOD2.9(P0.02/AIN0) R69.1
N$106: MOD2.19(P0.10/NFC2)
N$107: MOD2.18(P0.09/NFC1)
NEXT: MOD2.22(P0.14/TD[3]) ; also sheet 3,4,6
PLAY: MOD2.14(P0.05/AIN3) ; also sheet 3,4,6
PREV: MOD2.20(P0.11) ; also sheet 3,4,6
RESET: MOD2.21(P0.12) ; also sheet 3,4,6
TASTE0: MOD2.7(P0.30/AIN6) R59.1 SW9.A'(P1) SW9.A(P) ; also sheet 4
TASTE1: MOD2.5(P0.28/AIN4) R60.1 SW10.A'(P1) SW10.A(P) ; also sheet 4
TASTE2: MOD2.6(P0.29/AIN5) R61.1 SW11.A'(P1) SW11.A(P) ; also sheet 4
TASTE3: MOD2.4(P0.27) R62.1 SW12.A'(P1) SW12.A(P) ; also sheet 4
TASTE4: MOD2.3(P0.26) R63.1 SW13.A'(P1) SW13.A(P) ; also sheet 4
TASTE5: MOD2.2(P0.25) R64.1 SW14.A'(P1) SW14.A(P) ; also sheet 4
V+: R69.2 ; supply symbol labelled VBAT ; also sheet 2,4,5
Unconnected: J5.6 J5.7 J5.8 MOD2.10(P0.03/AIN1) MOD2.11(P0.04/AIN2) MOD2.27(P0.17) MOD2.28(P0.18/TD[0])

### Buses
SOUND_BUS:RESET,NEXT,PREV,DCLK,DIN,BUSY,PLAY
MUX_BUS:IN,/EN
TASTER_LED_BUS:TASTE[0..5],LED[0..1]

### Notes on the sheet
- Messung der Batteriespannung
- SWD-Schnittstelle und Reset
- Mikrokontroller mit BLE-Schnittstelle
- Tasten und LED-Streifen
- Vibrator
- NP
- Vibrationsmotor
- Mikrokontroller / Benutzerschnittstellen
- Schema V0.0
- 0.0

## Power pins joined to a net without a drawn wire
GND: IC2.4(GND) IC6.4(GND)

## Library data of the parts
C1-C58 = rcl:C-EU: CAPACITOR, European symbol; SPICEPREFIX: C
D1 D2 = diode:BAS40-05: Silicon Schottky Diodes General-purpose diode for high-speed switching
GND GND52 = TS3a27:TS3A27
IC1 IC4 = mcp73831:MCP73831
IC2 IC6 = linear-technology:LT1963EST: 1.5A, Low Noise, Fast Transient Response LDO Regulator Source: http://www.linear.com/pc/downloadDocument.do?navId=H0,C3,P2222,D3148; MPN: LT1963EST-1.5; OC_FARNELL: 1663528; OC_NEWARK: 57M7534
IC3 IC7 = VUB300:VUB300
IC5 IC8 = SparkFun-DigitalIC:WTV020SD: SD audio playback IC Can play back .wav or .ad4 files from an SD card SPI control or digital input trigger control available in SSOP-20 or DIP-20; PROD_#: NA; PROD_ID: IC-11012; SKU: NA; SPARKLE_ID: 6000
J1 J6 = USBZueg:629105136821: WR-COM SMT Horizontal 5 Contacts Micro USB Type B,5 pins=>Code : Con_I-O_COM_MicroUSB_629105136821 <http://katalog.we-online.de/media/images/eican/Con_I-O_COM_MicroUSB_629105136821_pf2.jpg> Details see: http://katalog.we-online.de/en/em/COM_MICRO_SMT_TYPE_B_HORIZONTAL/629105136821?m Created 2014-07-09, Karrer Zheng 2014 (C) Würth Elektronik
J2 J4 = InputOutputIO (rev18a)(1):693071010811: WR-CRD MICRO SD CARD CONNECTOR PUSH & PUSH WITH CARD DETECTION 8PINS=>Code : Con_I-O_COM_CRD_SD_Micro_693071010811 <http://katalog.we-online.de/media/images/eican/Con_I-O_COM_CRD_SD_Micro_693071010811_pf2.jpg> Details see: http://katalog.we-online.de/en/em/CRD_SD_MICRO_PUSH_AND_PULL_8_PINS/693071010811 Created 2014-07-09, Karrer Zheng 2014 (C) Würth Elektronik
J3 J5 = Nordic_misc:DEBUG_CONNECTOR
LED1-LED4 = eagle-ltspice:LED_E: LED Source: http://www.osram.convergy.de Source: www.luxeon.com Source: www.kingbright.com; SPICEMODEL: NONE; SPICEPREFIX: D; SPICETYPE: diode
MOD1 MOD2 = acn52832_eagle:ACM_52832_VER2: Aconno BLE 2,4 GHz Module nRF52832 based
R1-R76 = resistor:R-EU_: RESISTOR, European symbol
SW1-SW14 = Pro3E:SW_TACT_SMD
T1-T6 = zetex:PMOSSOT23: MOS FET; OC_FARNELL: unknown; OC_NEWARK: unknown
X1-X6 = con-phoenix-350:1751248: MKDS 1/ 2-3,5 Printklemme Nennstrom: 10 A Bemessungsspannung: 160 V Raster: 3,5 mm Polzahl: 2 Montageart: Löten Anschlussart: Schraubanschluss Anschlussrichtung vom Leiter zur Platine: 0° Source: http://eshop.phoenixcontact.com .. 1751248.pdf; OC_FARNELL: unknown; OC_NEWARK: unknown
Y1 Y2 = abracom:CRYSTAL